# EAGLE schematic Finger_PPG (EAGLE 9.6.1)
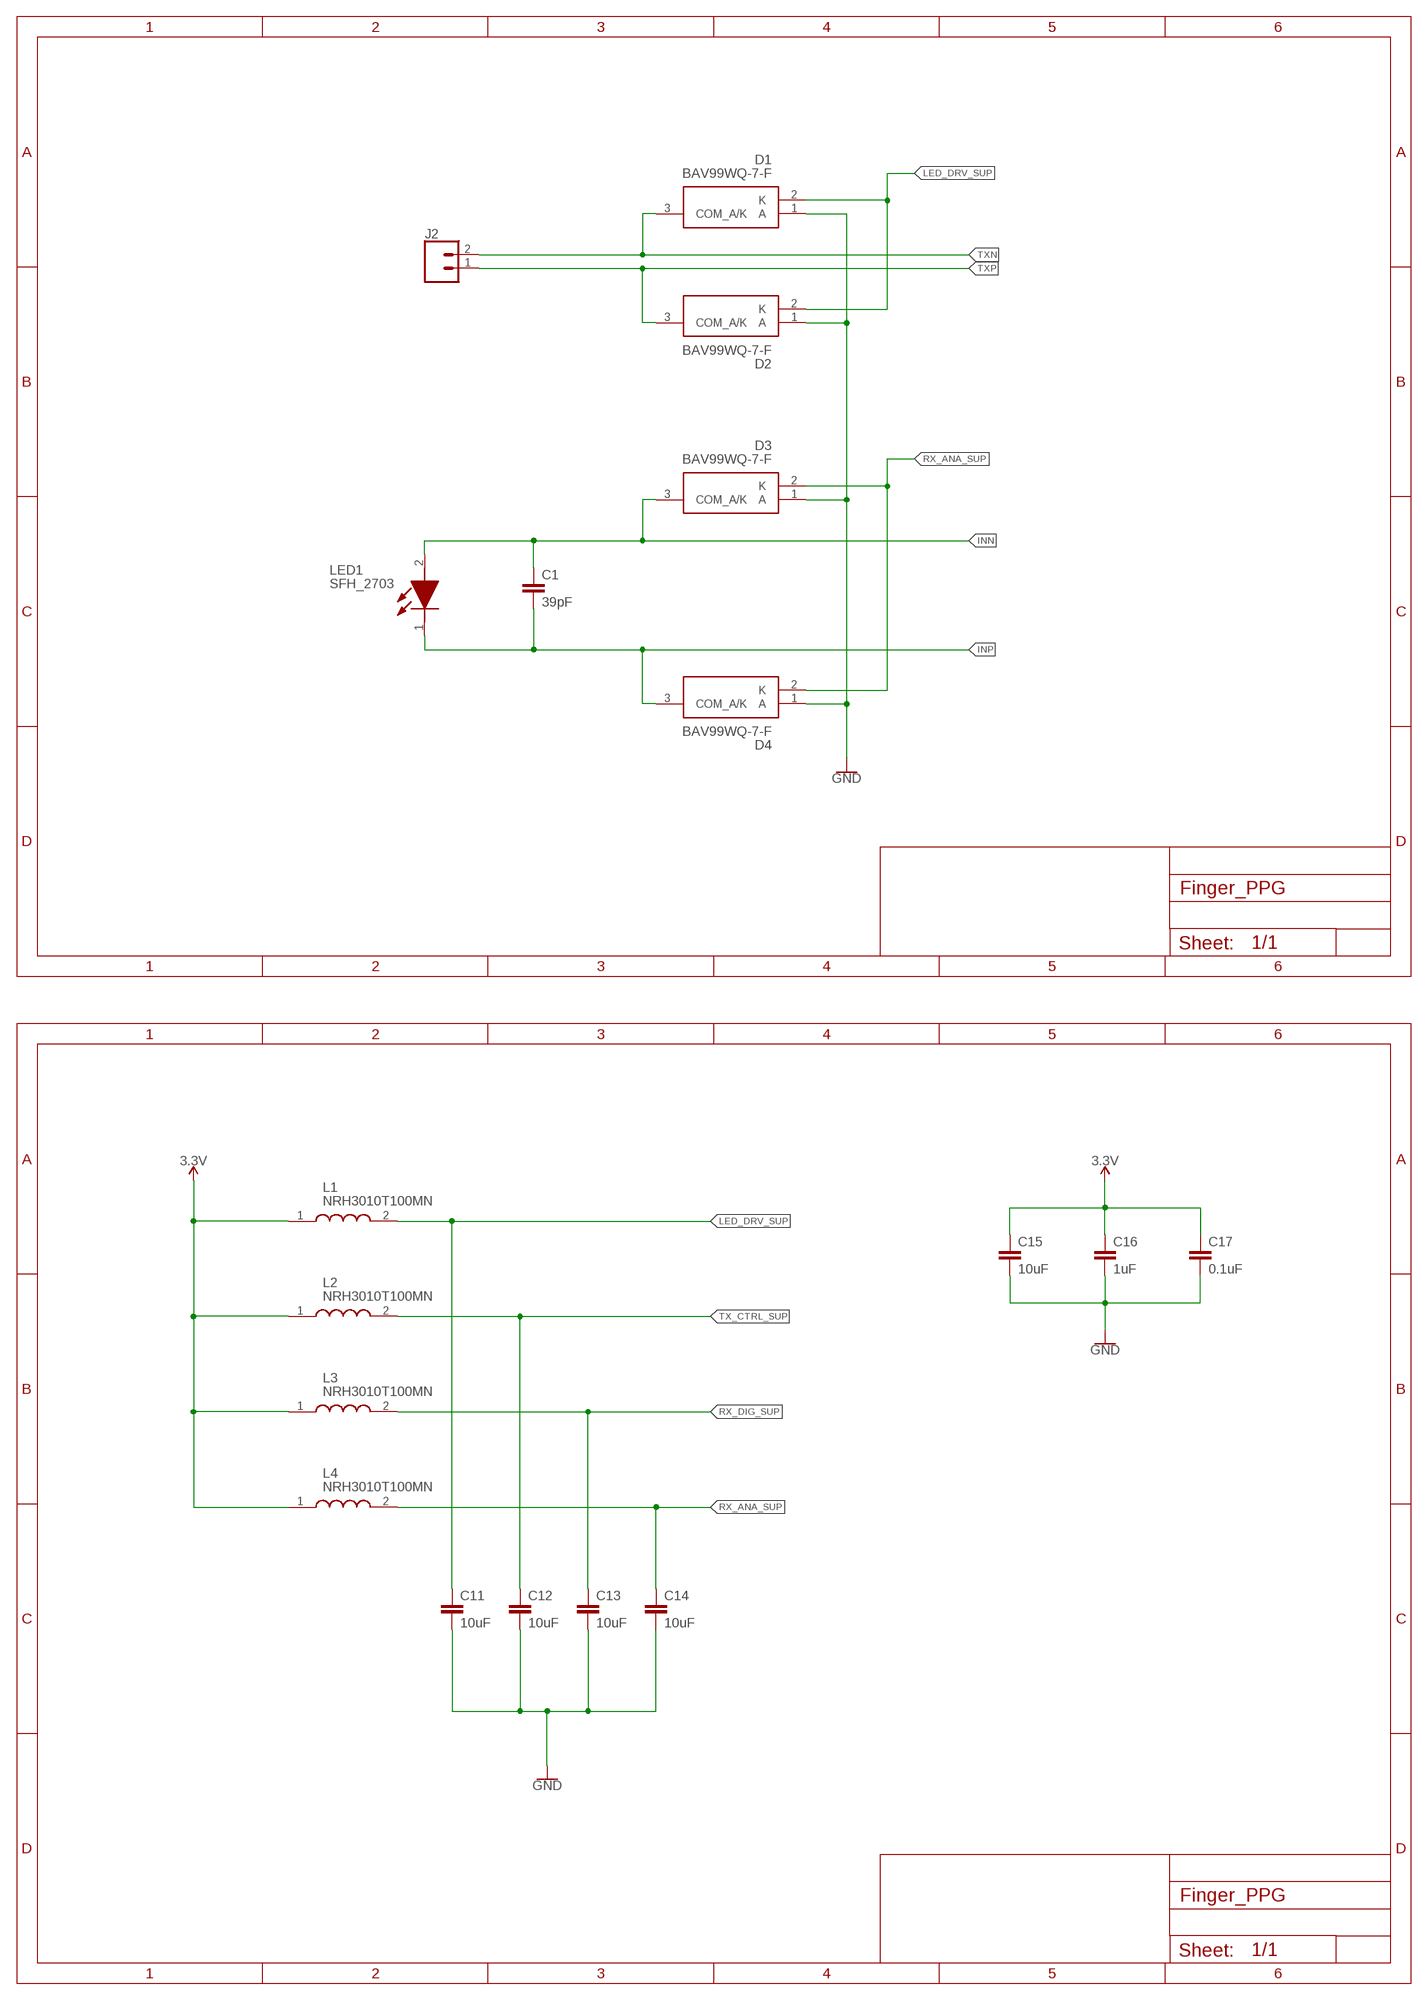
[diagram p0: schematic, sheet 1, part 1 of 2]
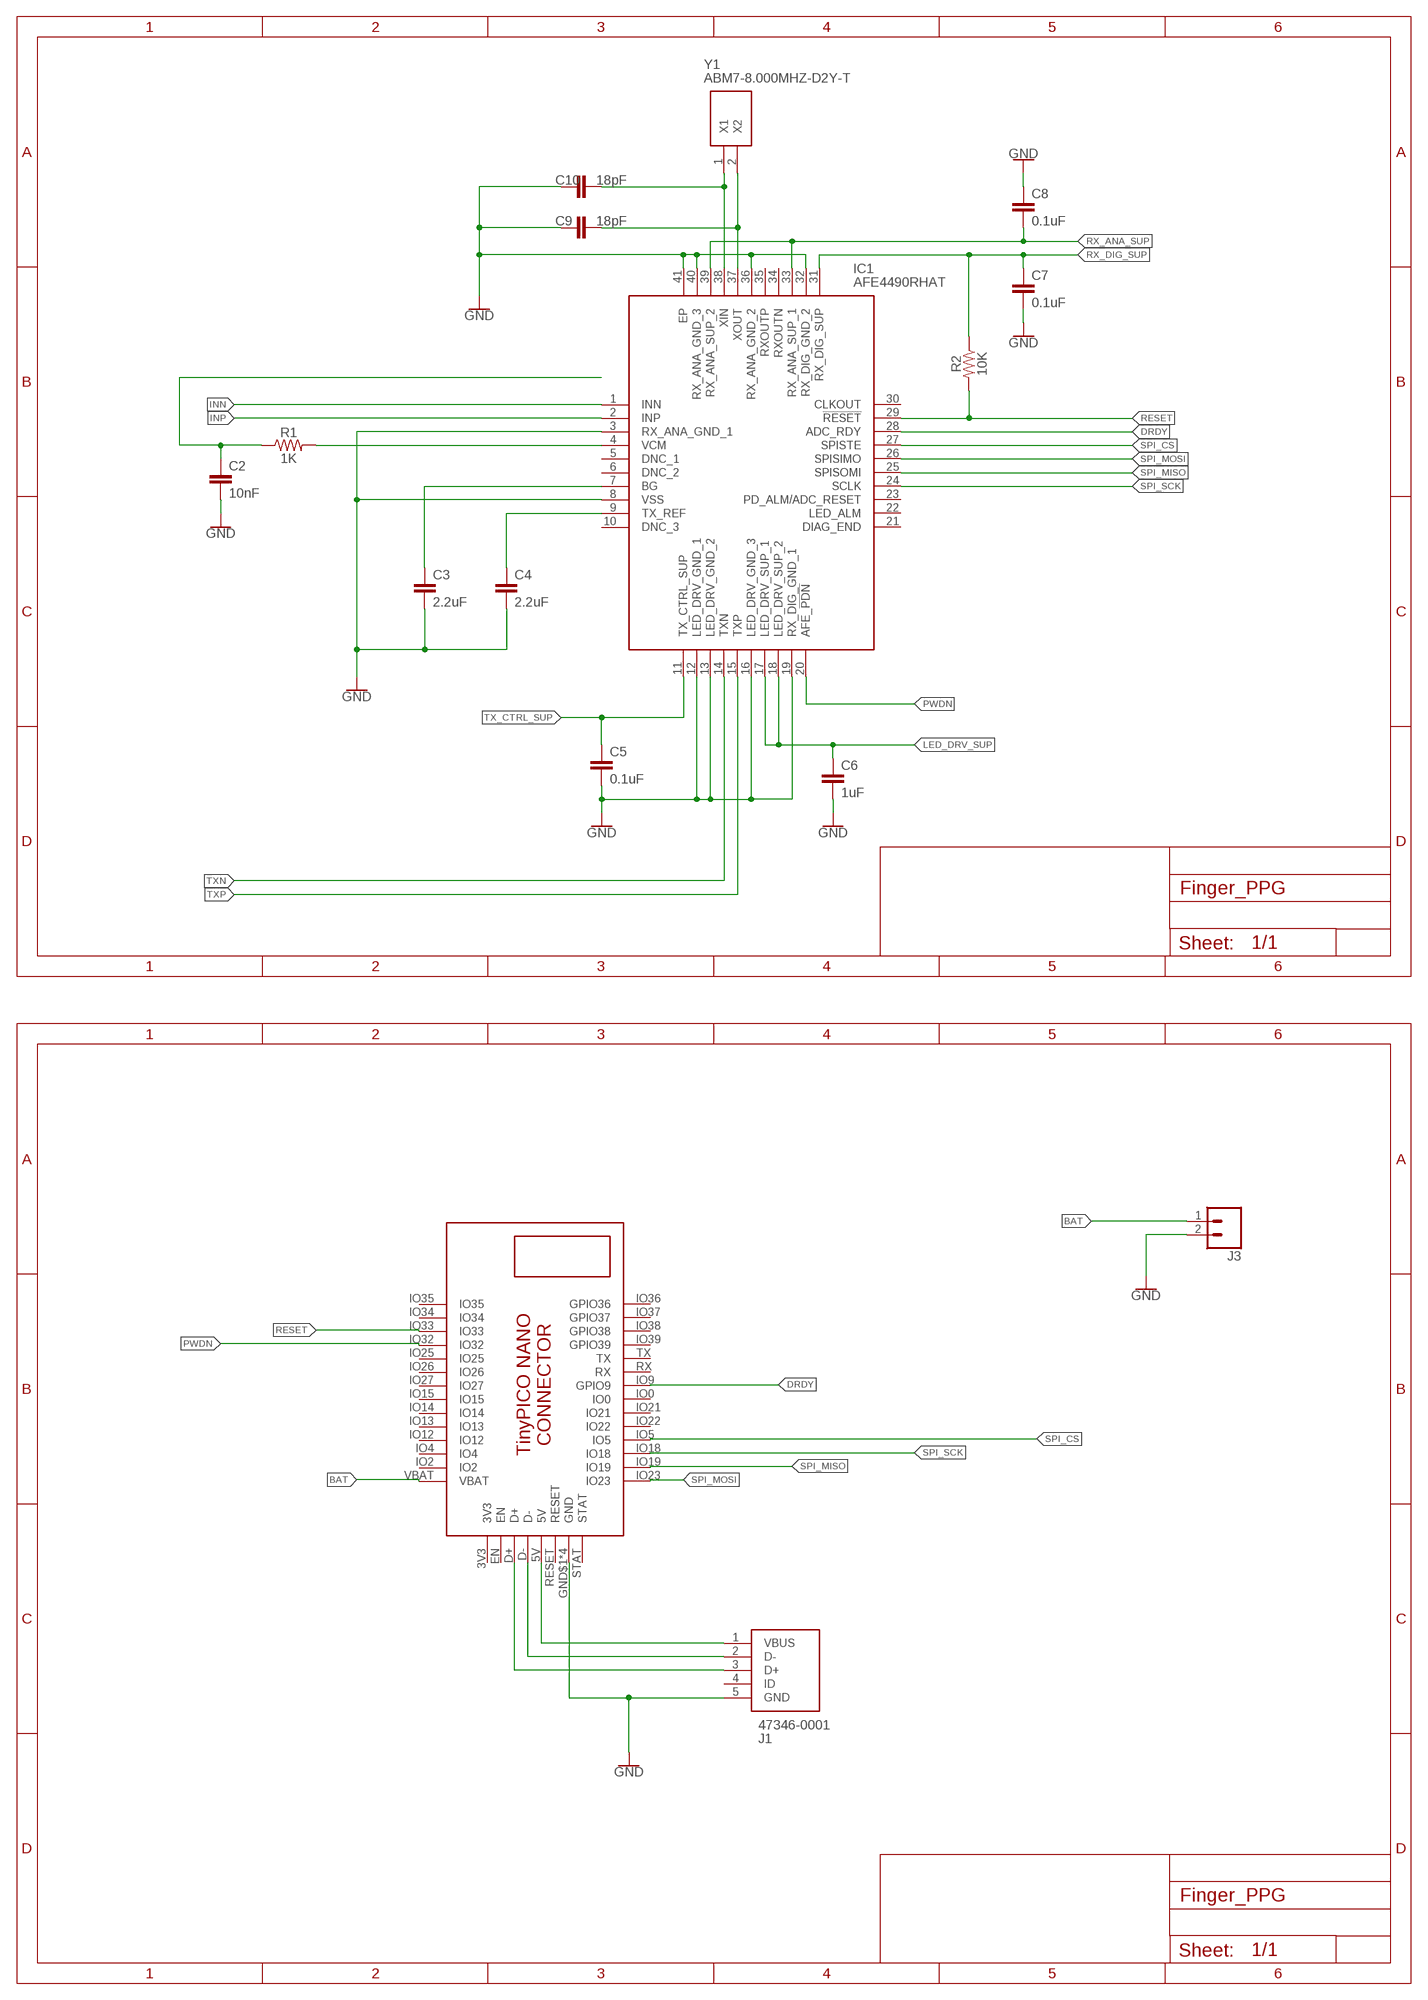
[diagram p1: schematic, sheet 1, part 2 of 2]

## Parts
C1  39pF  CAP-0402  [0402]
C2  10nF  CAP-0402  [0402]
C3  2.2uF  CAP-0603  [0603]
C4  2.2uF  CAP-0603  [0603]
C5  0.1uF  CAP-0402  [0402]
C6  1uF  CAP-0402  [0402]
C7  0.1uF  CAP-0402  [0402]
C8  0.1uF  CAP-0402  [0402]
C9  18pF  CAP-0402  [0402]
C10  18pF  CAP-0402  [0402]
C11  10uF  CAP-0805  [0805]
C12  10uF  CAP-0805  [0805]
C13  10uF  CAP-0805  [0805]
C14  10uF  CAP-0805  [0805]
C15  10uF  CAP-0805  [0805]
C16  1uF  CAP-0402  [0402]
C17  0.1uF  CAP-0402  [0402]
D1  BAV99WQ-7-F  [SOT65P210X110-3N]
D2  BAV99WQ-7-F  [SOT65P210X110-3N]
D3  BAV99WQ-7-F  [SOT65P210X110-3N]
D4  BAV99WQ-7-F  [SOT65P210X110-3N]
IC1  AFE4490RHAT  [QFN50P600X600X100-41N]
J1  47346-0001  [47346-0001]
J2  CONN_02  [1X02]
J3  CONN_02  [1X02]
L1  NRH3010T100MN  [NRH3010T100MN]
L2  NRH3010T100MN  [NRH3010T100MN]
L3  NRH3010T100MN  [NRH3010T100MN]
L4  NRH3010T100MN  [NRH3010T100MN]
LED1  SFH_2703  [SFH2703]
R1  1K  RESISTOR0402  [0402]
R2  10K  RESISTOR0402  [0402]
U$1  TINYPICO-NANO-CONNECTOR  [TINYPICO-NANO-CONNECTOR]
Y1  ABM7-8.000MHZ-D2Y-T  [ABM78000MHZD2YT]

## Nets
3.3V: C15.1 C16.1 C17.1 L1.1 L2.1 L3.1 L4.1
BAT: J3.1 U$1.VBAT
DRDY: IC1.28(ADC_RDY) U$1.IO9(GPIO9)
GND: C2.2 C3.2 C4.2 C5.2 C6.2 C7.2 C8.1 C9.1 C10.1 C11.2 C12.2 C13.2 C14.2 C15.2 C16.2 C17.2 D1.1(A) D2.1(A) D3.1(A) D4.1(A) IC1.3(RX_ANA_GND_1) IC1.8(VSS) IC1.12(LED_DRV_GND_1) IC1.13(LED_DRV_GND_2) IC1.16(LED_DRV_GND_3) IC1.19(RX_DIG_GND_1) IC1.32(RX_DIG_GND_2) IC1.36(RX_ANA_GND_2) IC1.40(RX_ANA_GND_3) IC1.41(EP) J1.5(GND) J3.2 U$1.GND$1(GND) U$1.GND$2(GND) U$1.GND$3(GND) U$1.GND$4(GND)
INN: C1.1 D3.3(COM_A/K) IC1.1(INN) LED1.2(A)
INP: C1.2 D4.3(COM_A/K) IC1.2(INP) LED1.1(K)
LED_DRV_SUP: C6.1 C11.1 D1.2(K) D2.2(K) IC1.17(LED_DRV_SUP_1) IC1.18(LED_DRV_SUP_2) L1.2
N$1: IC1.4(VCM) R1.2
N$2: C2.1 R1.1
N$3: C3.1 IC1.7(BG)
N$4: C4.1 IC1.9(TX_REF)
N$5: C10.2 IC1.38(XIN) Y1.1(X1)
N$6: C9.2 IC1.37(XOUT) Y1.2(X2)
N$7: J1.1(VBUS) U$1.5V
N$8: J1.2(D-) U$1.D-
N$9: J1.3(D+) U$1.D+
PWDN: IC1.20(AFE_!PDN) U$1.IO32
RESET: IC1.29(!RESET) R2.2 U$1.IO33
RX_ANA_SUP: C8.2 C14.1 D3.2(K) D4.2(K) IC1.33(RX_ANA_SUP_1) IC1.39(RX_ANA_SUP_2) L4.2
RX_DIG_SUP: C7.1 C13.1 IC1.31(RX_DIG_SUP) L3.2 R2.1
SPI_CS: IC1.27(SPISTE) U$1.IO5
SPI_MISO: IC1.25(SPISOMI) U$1.IO19
SPI_MOSI: IC1.26(SPISIMO) U$1.IO23
SPI_SCK: IC1.24(SCLK) U$1.IO18
TX_CTRL_SUP: C5.1 C12.1 IC1.11(TX_CTRL_SUP) L2.2
TXN: D1.3(COM_A/K) IC1.14(TXN) J2.2
TXP: D2.3(COM_A/K) IC1.15(TXP) J2.1
Unconnected: IC1.5(DNC_1) IC1.6(DNC_2) IC1.10(DNC_3) IC1.21(DIAG_END) IC1.22(LED_ALM) IC1.23(PD_ALM/ADC_RESET) IC1.30(CLKOUT) IC1.34(RXOUTN) IC1.35(RXOUTP) J1.4(ID) U$1.EN U$1.IO0 U$1.IO2 U$1.IO4 U$1.IO12 U$1.IO13 U$1.IO14 U$1.IO15 U$1.IO21 U$1.IO22 U$1.IO25 U$1.IO26 U$1.IO27 U$1.IO34 U$1.IO35 U$1.IO36(GPIO36) U$1.IO37(GPIO37) U$1.IO38(GPIO38) U$1.IO39(GPIO39) U$1.RESET U$1.RX U$1.STAT U$1.TX

## Power pins joined to a net without a drawn wire
3V3: U$1.3V3

## Library data of the parts
C1-C17 = SparkFun-Capacitors:CAP
D1-D4 = BAV99WQ-7-F:BAV99WQ-7-F: Diodes - General Purpose, Power, Switching Switching Diode SOT323 T&R 3K Source: Datasheet <https://www.arrow.com/en/products/bav99wq-7-f/diodes-incorporated>; ARROW_PART_NUMBER: BAV99WQ-7-F; ARROW_PRICE-STOCK: https://www.arrow.com/en/products/bav99wq-7-f/diodes-incorporated; DESCRIPTION: Diodes - General Purpose, Power, Switching Switching Diode SOT323 T&R 3K; HEIGHT: 1.1mm; MANUFACTURER_NAME: Diodes Inc.; MANUFACTURER_PART_NUMBER: BAV99WQ-7-F; MOUSER_PART_NUMBER: 621-BAV99WQ-7-F; MOUSER_PRICE-STOCK: https://www.mouser.co.uk/ProductDetail/Diodes-Incorporated/BAV99WQ-7-F?qs=lYGu3FyN48dnHzXSfXtQ4w%3D%3D
IC1 = AFE4490RHAT:AFE4490RHAT: Integrated Analog Front End (AFE) for Pulse Oximeters Source: Datasheet <http://www.ti.com/lit/ds/symlink/afe4490.pdf>; ARROW_PART_NUMBER: AFE4490RHAT; ARROW_PRICE-STOCK: https://www.arrow.com/en/products/afe4490rhat/texas-instruments?region=nac; DESCRIPTION: Integrated Analog Front End (AFE) for Pulse Oximeters; HEIGHT: 1mm; MANUFACTURER_NAME: Texas Instruments; MANUFACTURER_PART_NUMBER: AFE4490RHAT; MOUSER_PART_NUMBER: 595-AFE4490RHAT; MOUSER_PRICE-STOCK: https://www.mouser.co.uk/ProductDetail/Texas-Instruments/AFE4490RHAT?qs=%2FrNExBQRqESSJQye0pww9w%3D%3D
J1 = 47346-0001:47346-0001: Micro USB B Receptacle Bottom Mount Assy Molex Right Angle SMT Type B Version 2.0 Micro USB Connector Socket, 30 V ac, 1A 47352 MICRO-USB Source: Datasheet <http://www.molex.com/pdm_docs/sd/473460001_sd.pdf>; DESCRIPTION: Micro USB B Receptacle Bottom Mount Assy Molex Right Angle SMT Type B Version 2.0 Micro USB Connector Socket, 30 V ac, 1A 47352 MICRO-USB; HEIGHT: mm; MANUFACTURER_NAME: Molex; MANUFACTURER_PART_NUMBER: 47346-0001; MOUSER_PART_NUMBER: 538-47346-0001; MOUSER_PRICE-STOCK: https://www.mouser.co.uk/ProductDetail/Molex/47346-0001?qs=c2CV6XM0DweJBWaSeyWeCw%3D%3D
J2 J3 = SparkFun-Connectors:CONN_02: Multi connection point. Often used as Generic Header-pin footprint for 0.1 inch spaced/style header connections On any of the 0.1 inch spaced packages, you can populate with these: Break Away Headers - Straight <https://www.sparkfun.com/products/116> (PRT-00116) Break Away Male Headers - Right Angle <https://www.sparkfun.com/products/553> (PRT-00553) Female Headers <https://www.sparkfun.com/products/115> (PRT-00115) Break Away Headers - Machine Pin <https://www.sparkfun.com/products/117> (PRT-00117) Break Away Female Headers - Swiss Machine Pin <https://www.sparkfun.com/products/743> (PRT-00743) For SCREWTERMINALS and SPRING TERMINALS visit here: Screw Terimnals on SparkFun.com <https://www.sparkfun.com/search/results?term=Screw+Terminals> (5mm/3.5mm/2.54mm spacing) This device is also useful as a general connection point to wire up your design to another part of your project. Our various solder wires solder well into these plated through hole pads. Hook-Up Wire - Assortment (Stranded, 22 AWG) <https://www.sparkfun.com/products/11375> (PRT-11375) Hook-Up Wire - Assortment (Solid Core, 22 AWG) <https://www.sparkfun.com/products/11367> (PRT-11367) View the entire wire category on our website here <https://www.sparkfun.com/categories/141> Special notes: Molex polarized connector foot print use with: PRT-08233 with associated crimp pins and housings. 2.54_SCREWTERM for use with PRT-10571. 3.5mm Screw Terminal footprints for PRT-08084 5mm Screw Terminal footprints for use with PRT-08432
L1-L4 = NRH3010T100MN:NRH3010T100MN: NRH3010T100MN Source: Datasheet <https://ds.yuden.co.jp/TYCOMPAS/ut/detail?pn=NRH3010T100MN &u=M>; ARROW_PART_NUMBER: NRH3010T100MN; ARROW_PRICE-STOCK: https://www.arrow.com/en/products/nrh3010t100mn/taiyo-yuden; DESCRIPTION: NRH3010T100MN; HEIGHT: 1mm; MANUFACTURER_NAME: TAIYO YUDEN; MANUFACTURER_PART_NUMBER: NRH3010T100MN; MOUSER_PART_NUMBER: 963-NRH3010T100MN; MOUSER_PRICE-STOCK: https://www.mouser.co.uk/ProductDetail/Taiyo-Yuden/NRH3010T100MN?qs=PzICbMaShUd95UUkPGlXbA%3D%3D
LED1 = SFH_2703:SFH_2703: Photodiodes Silicon PIN Photodiode Source: Datasheet <https://www.osram.com/ecat/CHIPLED SFH 2703/com/en/class_pim_web_catalog_103489/global/prd_pim_device_8845307/>; DESCRIPTION: Photodiodes Silicon PIN Photodiode; HEIGHT: 0.7mm; MANUFACTURER_NAME: OSRAM; MANUFACTURER_PART_NUMBER: SFH 2703; MOUSER_PART_NUMBER: 720-SFH2703; MOUSER_PRICE-STOCK: https://www.mouser.co.uk/ProductDetail/OSRAM-Opto-Semiconductors/SFH-2703?qs=7MVldsJ5UaxRV%252BLvdVRbIA%3D%3D
R1 R2 = SparkFun-Resistors:RESISTOR: Generic Resistor Package
U$1 = TinyPICO_NANO_Eagle:TINYPICO-NANO-CONNECTOR: TinyPICO NANO Footprint https://www.tinypico.com/tinypico-nano
Y1 = ABM7-8.000MHZ-D2Y-T:ABM7-8.000MHZ-D2Y-T: ABRACON - ABM7-8.000MHZ-D2Y-T - CRYSTAL, 8MHZ, 18PF, SMD Source: Datasheet <http://www.abracon.com/Resonators/abm7.pdf>; ARROW_PART_NUMBER: ABM7-8.000MHZ-D2Y-T; ARROW_PRICE-STOCK: https://www.arrow.com/en/products/abm7-8.000mhz-d2y-t/abracon; DESCRIPTION: ABRACON - ABM7-8.000MHZ-D2Y-T - CRYSTAL, 8MHZ, 18PF, SMD; HEIGHT: 1.4mm; MANUFACTURER_NAME: ABRACON; MANUFACTURER_PART_NUMBER: ABM7-8.000MHZ-D2Y-T; MOUSER_PART_NUMBER: 815-ABM7-8-D2Y-T; MOUSER_PRICE-STOCK: https://www.mouser.co.uk/ProductDetail/ABRACON/ABM7-8000MHZ-D2Y-T?qs=LoTOQoUkC8SFsmY8snleBA%3D%3D